# Altium schematic sheet Eth_PHY_SCH (LAN8720A).SchDoc
size 209 x 297 mm
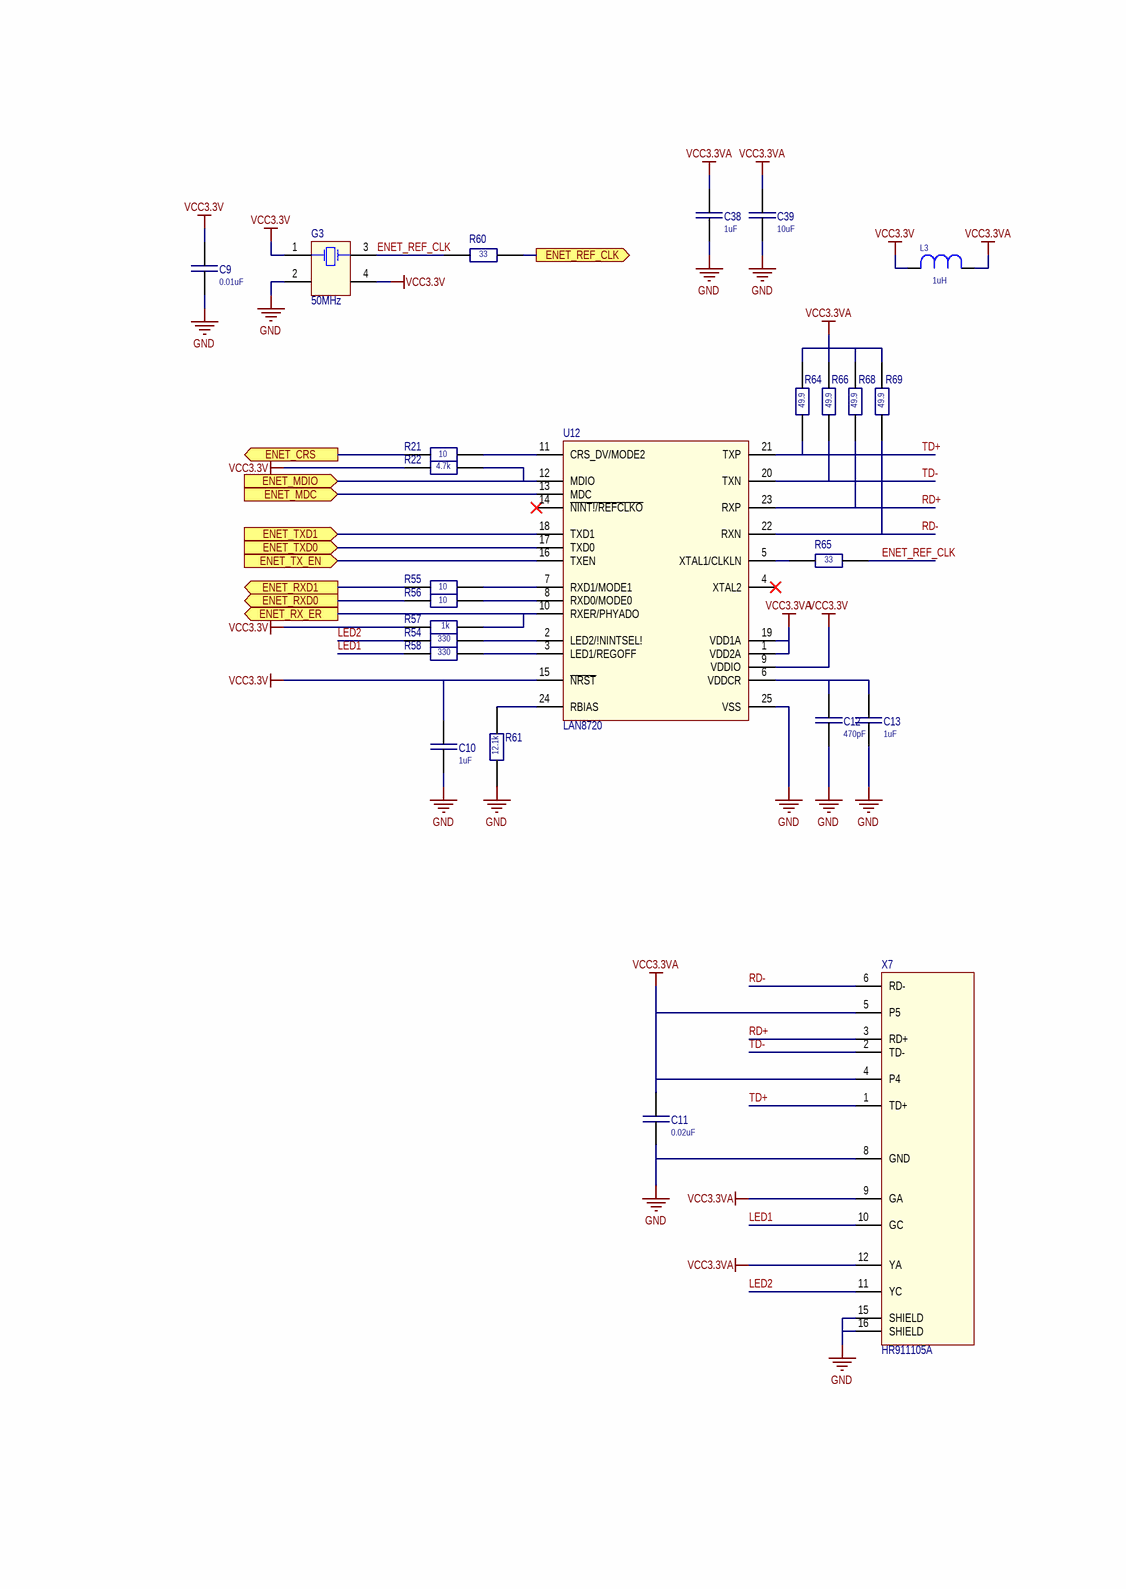
[diagram p0: Eth_PHY_SCH (LAN8720A).SchDoc]

## Parts
C9  0.01uF  [C_0603]
C10  1uF  [C_0603]
C11  0.02uF  [C_0603]
C12  470pF  [C_0603]
C13  1uF  [C_0603]
C38  1uF  [C_0603]
C39  10uF  [C_0603]
G3  50MHz  [XTAL_ASE-50.000MHZ-LR-T]
L3  1uH  [L_0603]
R21  10  [R_0603]
R22  4.7k  [R_0603]
R54  330  [R_0603]
R55  10  [R_0603]
R56  10  [R_0603]
R57  1k  [R_0603]
R58  330  [R_0603]
R60  33  [R_0603]
R61  12.1k  [R_0603]
R64  49.9  [R_0603]
R65  33  [R_0603]
R66  49.9  [R_0603]
R68  49.9  [R_0603]
R69  49.9  [R_0603]
U12  LAN8720  [QFN50P400X400X100-25N]
X7  HR911105A  [HR911105A_HANRUN]

## Ports
ENET_CRS (out), ENET_MDC (in), ENET_MDIO (in), ENET_REF_CLK (out), ENET_RX_ER (out), ENET_RXD0 (out), ENET_RXD1 (out), ENET_TX_EN (in), ENET_TXD0 (in), ENET_TXD1 (in)

## Nets
GND: C9.1 C10.1 C11.1 C12.1 C13.1 C38.1 C39.1 G3.2(GND) R61.1 U12.25(VSS) X7.8(GND) X7.15(SHIELD) X7.16(SHIELD)
VCC3.3V: C9.2 C10.2 G3.1(Tri_State) G3.4(VDD) L3.2 R22.1 R57.1 U12.9(VDDIO) U12.15(~{NRST})
VCC3.3VA: C11.2 C38.2 C39.2 L3.1 R64.2 R66.2 R68.2 R69.2 U12.1(VDD2A) U12.19(VDD1A) X7.4(P4) X7.5(P5) X7.9(GA) X7.12(YA)
ENET_CRS: R21.1 ; port ENET_CRS
ENET_MDC: U12.13(MDC) ; port ENET_MDC
ENET_MDIO: R22.2 U12.12(MDIO) ; port ENET_MDIO
ENET_REF_CLK: G3.3(Output) R60.1 R65.2
ENET_REF_CLK: R60.2 ; port ENET_REF_CLK  [a separate net that carries the same name]
ENET_RX_ER: R57.2 U12.10(RXER/PHYADO) ; port ENET_RX_ER
ENET_RXD0: R56.1 ; port ENET_RXD0
ENET_RXD1: R55.1 ; port ENET_RXD1
ENET_TX_EN: U12.16(TXEN) ; port ENET_TX_EN
ENET_TXD0: U12.17(TXD0) ; port ENET_TXD0
ENET_TXD1: U12.18(TXD1) ; port ENET_TXD1
LED1: R58.2 X7.10(GC)
LED2: R54.2 X7.11(YC)
RD+: R68.1 U12.23(RXP) X7.3(RD+)
RD-: R69.1 U12.22(RXN) X7.6(RD-)
TD+: R64.1 U12.21(TXP) X7.1(TD+)
TD-: R66.1 U12.20(TXN) X7.2(TD-)
NetC12_2: C12.2 C13.2 U12.6(VDDCR)
NetR21_2: R21.2 U12.11(CRS_DV/MODE2)
NetR54_1: R54.1 U12.2(LED2/!NINTSEL!)
NetR55_2: R55.2 U12.7(RXD1/MODE1)
NetR56_2: R56.2 U12.8(RXD0/MODE0)
NetR58_1: R58.1 U12.3(LED1/REGOFF)
NetR61_2: R61.2 U12.24(RBIAS)
NetR65_1: R65.1 U12.5(XTAL1/CLKLN)

Not connected (* = marked no-connect by the designer): U12 4(XTAL2)* 14(~{NINT!/REFCLKO})*

## Library data of the parts
C9 = CAP_SMD: Capacitor; Part Number: CC0603KRX7R7BB103; Alternative Part: *; Value: 0.01uF
C10 C13 C38 = CAP_SMD: Capacitor; Part Number: CC0603KRX7R9BB105; Alternative Part: *; Value: 1uF
C11 = CAP_SMD: Capacitor; Part Number: CC0603KRX7R9BB223; Alternative Part: *; Value: 0.02uF
C12 = CAP_SMD: Capacitor; Part Number: CC0603KRX7R9BB471; Alternative Part: *; Value: 470pF
C39 = CAP_SMD: Capacitor; Part Number: CC0603KRX5R6BB106; Alternative Part: *; Value: 10uF
G3 = ASE: Quartz Generator; Part: ASE-50.000MHZ-LR-T; Value: 50MHz
L3 = L_0603: Inductor; Part Number: LQM18FN1R0M00D; Value: 1uH
R21 R55 R56 = RES_SMD: Resistor; Part Number: RC0603FR-0710R2L; Alternative Part: *; Value: 10
R22 = RES_SMD: Resistor; Part Number: RC0603FR-134K7L; Alternative Part: *; Value: 4.7k
R54 R58 = RES_SMD: Resistor; Part Number: RC0603FR-07330KL; Alternative Part: *; Value: 330
R57 = RES_SMD: Resistor; Part Number: RC0603FR-071KL; Alternative Part: *; Value: 1k
R60 R65 = RES_SMD: Resistor; Part Number: RC0603FR-0733RL; Alternative Part: *; Value: 33
R61 = RES_SMD: Resistor; Part Number: *; Alternative Part: *; Value: 12.1k
R64 R66 R68 R69 = RES_SMD: Resistor; Part Number: RC0603FR-0749R9L; Alternative Part: *; Value: 49.9
U12 = LAN8720: Phy Eth 2/2 Transceiver Full RMII 24-QFN-EP _4x4_; MF: Microchip; MP: LAN8720A-CP; Package: QFN-24 Microchip; Value: *; Price: None; SnapEDA_Link: https://www.snapeda.com/parts/LAN8720A-CP/Microchip/view-part/237160/?ref=snap; Availability: Unavailable; Part Number: LAN8720; Alternative Part: *
X7 = HR911105A: DIP RJ45 Connector;; Package: None; MP: HR911105A; Value: *; Price: None; Availability: Unavailable; Part Number: HR911105A; Alternative Part: *